# Altium schematic sheet 14_FPGA_banks_7A_8A.SchDoc: FPGA banks 7A, 8A
size A3; Organization: Lime Microsystems; Address1: Surrey Tech Centre; Address2: Guildford GU2 7YG; Address3: Surrey; Address4: United Kingdom; Revision: v1.2; SheetNumber: 12; SheetTotal: 27
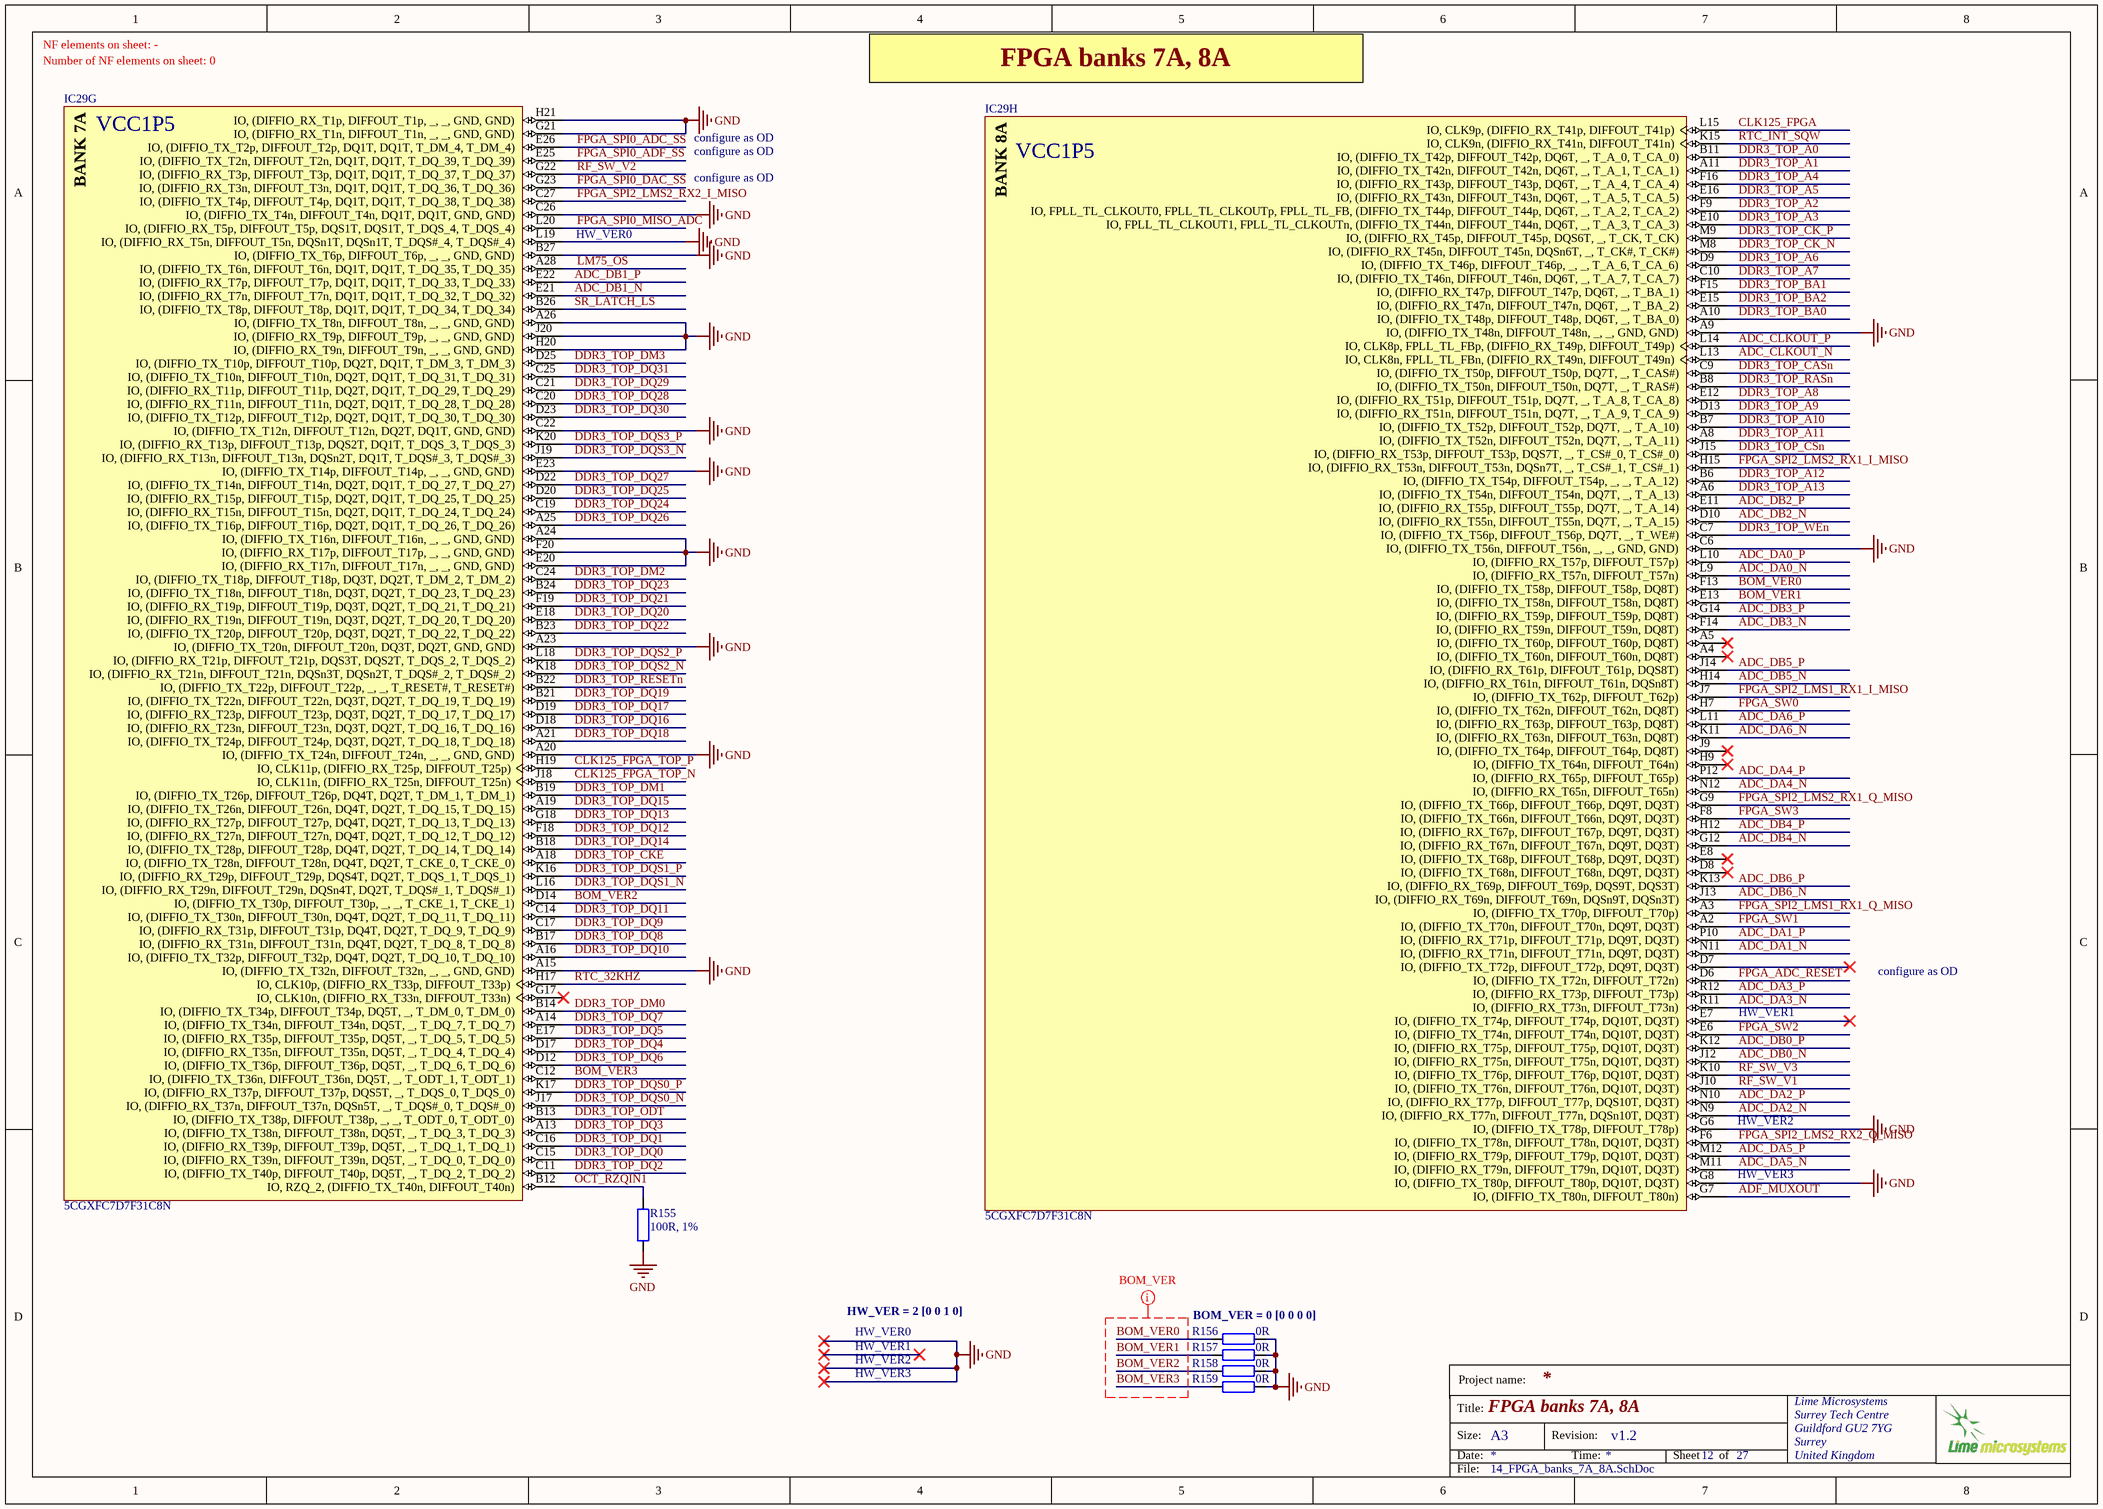
[diagram p0: 14_FPGA_banks_7A_8A.SchDoc]

## Parts
IC29  5CGXFC7D7F31C8N  [ALTR-FBGA896_A-200]  (parts G,H of 16)
R155  100R, 1%  [RES0402]
R156  0R  [RES0402]
R157  0R  [RES0402]
R158  0R  [RES0402]
R159  0R  [RES0402]

## Nets
GND: IC29.A9(IO,_(DIFFIO_TX_T48n,_DIFFOUT_T48n,__,__,_GND,_GND)) IC29.A15(IO,_(DIFFIO_TX_T32n,_DIFFOUT_T32n,__,__,_GND,_GND)) IC29.A20(IO,_(DIFFIO_TX_T24n,_DIFFOUT_T24n,__,__,_GND,_GND)) IC29.A23(IO,_(DIFFIO_TX_T20n,_DIFFOUT_T20n,_DQ3T,_DQ2T,_GND,_GND)) IC29.A24(IO,_(DIFFIO_TX_T16n,_DIFFOUT_T16n,__,__,_GND,_GND)) IC29.A26(IO,_(DIFFIO_TX_T8n,_DIFFOUT_T8n,__,__,_GND,_GND)) IC29.B27(IO,_(DIFFIO_TX_T6p,_DIFFOUT_T6p,__,__,_GND,_GND)) IC29.C6(IO,_(DIFFIO_TX_T56n,_DIFFOUT_T56n,__,__,_GND,_GND)) IC29.C22(IO,_(DIFFIO_TX_T12n,_DIFFOUT_T12n,_DQ2T,_DQ1T,_GND,_GND)) IC29.C26(IO,_(DIFFIO_TX_T4n,_DIFFOUT_T4n,_DQ1T,_DQ1T,_GND,_GND)) IC29.E20(IO,_(DIFFIO_RX_T17n,_DIFFOUT_T17n,__,__,_GND,_GND)) IC29.E23(IO,_(DIFFIO_TX_T14p,_DIFFOUT_T14p,__,__,_GND,_GND)) IC29.F20(IO,_(DIFFIO_RX_T17p,_DIFFOUT_T17p,__,__,_GND,_GND)) IC29.G6(IO,_(DIFFIO_TX_T78p,_DIFFOUT_T78p)) IC29.G8(IO,_(DIFFIO_TX_T80p,_DIFFOUT_T80p,_DQ10T,_DQ3T)) IC29.G21(IO,_(DIFFIO_RX_T1n,_DIFFOUT_T1n,__,__,_GND,_GND)) IC29.H20(IO,_(DIFFIO_RX_T9n,_DIFFOUT_T9n,__,__,_GND,_GND)) IC29.H21(IO,_(DIFFIO_RX_T1p,_DIFFOUT_T1p,__,__,_GND,_GND)) IC29.J20(IO,_(DIFFIO_RX_T9p,_DIFFOUT_T9p,__,__,_GND,_GND)) IC29.L19(IO,_(DIFFIO_RX_T5n,_DIFFOUT_T5n,_DQSn1T,_DQSn1T,_T_DQS#_4,_T_DQS#_4)) R155.1 R156.2 R157.2 R158.2 R159.2
ADC_CLKOUT_N: IC29.L13(IO,_CLK8n,_FPLL_TL_FBn,_(DIFFIO_RX_T49n,_DIFFOUT_T49n))
ADC_CLKOUT_P: IC29.L14(IO,_CLK8p,_FPLL_TL_FBp,_(DIFFIO_RX_T49p,_DIFFOUT_T49p))
ADC_DA0_N: IC29.L9(IO,_(DIFFIO_RX_T57n,_DIFFOUT_T57n))
ADC_DA0_P: IC29.L10(IO,_(DIFFIO_RX_T57p,_DIFFOUT_T57p))
ADC_DA1_N: IC29.N11(IO,_(DIFFIO_RX_T71n,_DIFFOUT_T71n,_DQ9T,_DQ3T))
ADC_DA1_P: IC29.P10(IO,_(DIFFIO_RX_T71p,_DIFFOUT_T71p,_DQ9T,_DQ3T))
ADC_DA2_N: IC29.N9(IO,_(DIFFIO_RX_T77n,_DIFFOUT_T77n,_DQSn10T,_DQ3T))
ADC_DA2_P: IC29.N10(IO,_(DIFFIO_RX_T77p,_DIFFOUT_T77p,_DQS10T,_DQ3T))
ADC_DA3_N: IC29.R11(IO,_(DIFFIO_RX_T73n,_DIFFOUT_T73n))
ADC_DA3_P: IC29.R12(IO,_(DIFFIO_RX_T73p,_DIFFOUT_T73p))
ADC_DA4_N: IC29.N12(IO,_(DIFFIO_RX_T65n,_DIFFOUT_T65n))
ADC_DA4_P: IC29.P12(IO,_(DIFFIO_RX_T65p,_DIFFOUT_T65p))
ADC_DA5_N: IC29.M11(IO,_(DIFFIO_RX_T79n,_DIFFOUT_T79n,_DQ10T,_DQ3T))
ADC_DA5_P: IC29.M12(IO,_(DIFFIO_RX_T79p,_DIFFOUT_T79p,_DQ10T,_DQ3T))
ADC_DA6_N: IC29.K11(IO,_(DIFFIO_RX_T63n,_DIFFOUT_T63n,_DQ8T))
ADC_DA6_P: IC29.L11(IO,_(DIFFIO_RX_T63p,_DIFFOUT_T63p,_DQ8T))
ADC_DB0_N: IC29.J12(IO,_(DIFFIO_RX_T75n,_DIFFOUT_T75n,_DQ10T,_DQ3T))
ADC_DB0_P: IC29.K12(IO,_(DIFFIO_RX_T75p,_DIFFOUT_T75p,_DQ10T,_DQ3T))
ADC_DB1_N: IC29.E21(IO,_(DIFFIO_RX_T7n,_DIFFOUT_T7n,_DQ1T,_DQ1T,_T_DQ_32,_T_DQ_32))
ADC_DB1_P: IC29.E22(IO,_(DIFFIO_RX_T7p,_DIFFOUT_T7p,_DQ1T,_DQ1T,_T_DQ_33,_T_DQ_33))
ADC_DB2_N: IC29.D10(IO,_(DIFFIO_RX_T55n,_DIFFOUT_T55n,_DQ7T,__,_T_A_15))
ADC_DB2_P: IC29.E11(IO,_(DIFFIO_RX_T55p,_DIFFOUT_T55p,_DQ7T,__,_T_A_14))
ADC_DB3_N: IC29.F14(IO,_(DIFFIO_RX_T59n,_DIFFOUT_T59n,_DQ8T))
ADC_DB3_P: IC29.G14(IO,_(DIFFIO_RX_T59p,_DIFFOUT_T59p,_DQ8T))
ADC_DB4_N: IC29.G12(IO,_(DIFFIO_RX_T67n,_DIFFOUT_T67n,_DQ9T,_DQ3T))
ADC_DB4_P: IC29.H12(IO,_(DIFFIO_RX_T67p,_DIFFOUT_T67p,_DQ9T,_DQ3T))
ADC_DB5_N: IC29.H14(IO,_(DIFFIO_RX_T61n,_DIFFOUT_T61n,_DQSn8T))
ADC_DB5_P: IC29.J14(IO,_(DIFFIO_RX_T61p,_DIFFOUT_T61p,_DQS8T))
ADC_DB6_N: IC29.J13(IO,_(DIFFIO_RX_T69n,_DIFFOUT_T69n,_DQSn9T,_DQSn3T))
ADC_DB6_P: IC29.K13(IO,_(DIFFIO_RX_T69p,_DIFFOUT_T69p,_DQS9T,_DQS3T))
ADF_MUXOUT: IC29.G7(IO,_(DIFFIO_TX_T80n,_DIFFOUT_T80n))
BOM_VER0: IC29.F13(IO,_(DIFFIO_TX_T58p,_DIFFOUT_T58p,_DQ8T)) R156.1
BOM_VER1: IC29.E13(IO,_(DIFFIO_TX_T58n,_DIFFOUT_T58n,_DQ8T)) R157.1
BOM_VER2: IC29.D14(IO,_(DIFFIO_TX_T30p,_DIFFOUT_T30p,__,__,_T_CKE_1,_T_CKE_1)) R158.1
BOM_VER3: IC29.C12(IO,_(DIFFIO_TX_T36n,_DIFFOUT_T36n,_DQ5T,__,_T_ODT_1,_T_ODT_1)) R159.1
CLK125_FPGA: IC29.L15(IO,_CLK9p,_(DIFFIO_RX_T41p,_DIFFOUT_T41p))
CLK125_FPGA_TOP_N: IC29.J18(IO,_CLK11n,_(DIFFIO_RX_T25n,_DIFFOUT_T25n))
CLK125_FPGA_TOP_P: IC29.H19(IO,_CLK11p,_(DIFFIO_RX_T25p,_DIFFOUT_T25p))
DDR3_TOP_A0: IC29.B11(IO,_(DIFFIO_TX_T42p,_DIFFOUT_T42p,_DQ6T,__,_T_A_0,_T_CA_0))
DDR3_TOP_A1: IC29.A11(IO,_(DIFFIO_TX_T42n,_DIFFOUT_T42n,_DQ6T,__,_T_A_1,_T_CA_1))
DDR3_TOP_A2: IC29.F9(IO,_FPLL_TL_CLKOUT0,_FPLL_TL_CLKOUTp,_FPLL_TL_FB,_(DIFFIO_TX_T44p,_DIFFOUT_T44p,_DQ6T,__,_T_A_2,_T_CA_2))
DDR3_TOP_A3: IC29.E10(IO,_FPLL_TL_CLKOUT1,_FPLL_TL_CLKOUTn,_(DIFFIO_TX_T44n,_DIFFOUT_T44n,_DQ6T,__,_T_A_3,_T_CA_3))
DDR3_TOP_A4: IC29.F16(IO,_(DIFFIO_RX_T43p,_DIFFOUT_T43p,_DQ6T,__,_T_A_4,_T_CA_4))
DDR3_TOP_A5: IC29.E16(IO,_(DIFFIO_RX_T43n,_DIFFOUT_T43n,_DQ6T,__,_T_A_5,_T_CA_5))
DDR3_TOP_A6: IC29.D9(IO,_(DIFFIO_TX_T46p,_DIFFOUT_T46p,__,__,_T_A_6,_T_CA_6))
DDR3_TOP_A7: IC29.C10(IO,_(DIFFIO_TX_T46n,_DIFFOUT_T46n,_DQ6T,__,_T_A_7,_T_CA_7))
DDR3_TOP_A8: IC29.E12(IO,_(DIFFIO_RX_T51p,_DIFFOUT_T51p,_DQ7T,__,_T_A_8,_T_CA_8))
DDR3_TOP_A9: IC29.D13(IO,_(DIFFIO_RX_T51n,_DIFFOUT_T51n,_DQ7T,__,_T_A_9,_T_CA_9))
DDR3_TOP_A10: IC29.B7(IO,_(DIFFIO_TX_T52p,_DIFFOUT_T52p,_DQ7T,__,_T_A_10))
DDR3_TOP_A11: IC29.A8(IO,_(DIFFIO_TX_T52n,_DIFFOUT_T52n,_DQ7T,__,_T_A_11))
DDR3_TOP_A12: IC29.B6(IO,_(DIFFIO_TX_T54p,_DIFFOUT_T54p,__,__,_T_A_12))
DDR3_TOP_A13: IC29.A6(IO,_(DIFFIO_TX_T54n,_DIFFOUT_T54n,_DQ7T,__,_T_A_13))
DDR3_TOP_BA0: IC29.A10(IO,_(DIFFIO_TX_T48p,_DIFFOUT_T48p,_DQ6T,__,_T_BA_0))
DDR3_TOP_BA1: IC29.F15(IO,_(DIFFIO_RX_T47p,_DIFFOUT_T47p,_DQ6T,__,_T_BA_1))
DDR3_TOP_BA2: IC29.E15(IO,_(DIFFIO_RX_T47n,_DIFFOUT_T47n,_DQ6T,__,_T_BA_2))
DDR3_TOP_CASn: IC29.C9(IO,_(DIFFIO_TX_T50p,_DIFFOUT_T50p,_DQ7T,__,_T_CAS#))
DDR3_TOP_CK_N: IC29.M8(IO,_(DIFFIO_RX_T45n,_DIFFOUT_T45n,_DQSn6T,__,_T_CK#,_T_CK#))
DDR3_TOP_CK_P: IC29.M9(IO,_(DIFFIO_RX_T45p,_DIFFOUT_T45p,_DQS6T,__,_T_CK,_T_CK))
DDR3_TOP_CKE: IC29.A18(IO,_(DIFFIO_TX_T28n,_DIFFOUT_T28n,_DQ4T,_DQ2T,_T_CKE_0,_T_CKE_0))
DDR3_TOP_CSn: IC29.J15(IO,_(DIFFIO_RX_T53p,_DIFFOUT_T53p,_DQS7T,__,_T_CS#_0,_T_CS#_0))
DDR3_TOP_DM0: IC29.B14(IO,_(DIFFIO_TX_T34p,_DIFFOUT_T34p,_DQ5T,__,_T_DM_0,_T_DM_0))
DDR3_TOP_DM1: IC29.B19(IO,_(DIFFIO_TX_T26p,_DIFFOUT_T26p,_DQ4T,_DQ2T,_T_DM_1,_T_DM_1))
DDR3_TOP_DM2: IC29.C24(IO,_(DIFFIO_TX_T18p,_DIFFOUT_T18p,_DQ3T,_DQ2T,_T_DM_2,_T_DM_2))
DDR3_TOP_DM3: IC29.D25(IO,_(DIFFIO_TX_T10p,_DIFFOUT_T10p,_DQ2T,_DQ1T,_T_DM_3,_T_DM_3))
DDR3_TOP_DQ0: IC29.C15(IO,_(DIFFIO_RX_T39n,_DIFFOUT_T39n,_DQ5T,__,_T_DQ_0,_T_DQ_0))
DDR3_TOP_DQ1: IC29.C16(IO,_(DIFFIO_RX_T39p,_DIFFOUT_T39p,_DQ5T,__,_T_DQ_1,_T_DQ_1))
DDR3_TOP_DQ2: IC29.C11(IO,_(DIFFIO_TX_T40p,_DIFFOUT_T40p,_DQ5T,__,_T_DQ_2,_T_DQ_2))
DDR3_TOP_DQ3: IC29.A13(IO,_(DIFFIO_TX_T38n,_DIFFOUT_T38n,_DQ5T,__,_T_DQ_3,_T_DQ_3))
DDR3_TOP_DQ4: IC29.D17(IO,_(DIFFIO_RX_T35n,_DIFFOUT_T35n,_DQ5T,__,_T_DQ_4,_T_DQ_4))
DDR3_TOP_DQ5: IC29.E17(IO,_(DIFFIO_RX_T35p,_DIFFOUT_T35p,_DQ5T,__,_T_DQ_5,_T_DQ_5))
DDR3_TOP_DQ6: IC29.D12(IO,_(DIFFIO_TX_T36p,_DIFFOUT_T36p,_DQ5T,__,_T_DQ_6,_T_DQ_6))
DDR3_TOP_DQ7: IC29.A14(IO,_(DIFFIO_TX_T34n,_DIFFOUT_T34n,_DQ5T,__,_T_DQ_7,_T_DQ_7))
DDR3_TOP_DQ8: IC29.B17(IO,_(DIFFIO_RX_T31n,_DIFFOUT_T31n,_DQ4T,_DQ2T,_T_DQ_8,_T_DQ_8))
DDR3_TOP_DQ9: IC29.C17(IO,_(DIFFIO_RX_T31p,_DIFFOUT_T31p,_DQ4T,_DQ2T,_T_DQ_9,_T_DQ_9))
DDR3_TOP_DQ10: IC29.A16(IO,_(DIFFIO_TX_T32p,_DIFFOUT_T32p,_DQ4T,_DQ2T,_T_DQ_10,_T_DQ_10))
DDR3_TOP_DQ11: IC29.C14(IO,_(DIFFIO_TX_T30n,_DIFFOUT_T30n,_DQ4T,_DQ2T,_T_DQ_11,_T_DQ_11))
DDR3_TOP_DQ12: IC29.F18(IO,_(DIFFIO_RX_T27n,_DIFFOUT_T27n,_DQ4T,_DQ2T,_T_DQ_12,_T_DQ_12))
DDR3_TOP_DQ13: IC29.G18(IO,_(DIFFIO_RX_T27p,_DIFFOUT_T27p,_DQ4T,_DQ2T,_T_DQ_13,_T_DQ_13))
DDR3_TOP_DQ14: IC29.B18(IO,_(DIFFIO_TX_T28p,_DIFFOUT_T28p,_DQ4T,_DQ2T,_T_DQ_14,_T_DQ_14))
DDR3_TOP_DQ15: IC29.A19(IO,_(DIFFIO_TX_T26n,_DIFFOUT_T26n,_DQ4T,_DQ2T,_T_DQ_15,_T_DQ_15))
DDR3_TOP_DQ16: IC29.D18(IO,_(DIFFIO_RX_T23n,_DIFFOUT_T23n,_DQ3T,_DQ2T,_T_DQ_16,_T_DQ_16))
DDR3_TOP_DQ17: IC29.D19(IO,_(DIFFIO_RX_T23p,_DIFFOUT_T23p,_DQ3T,_DQ2T,_T_DQ_17,_T_DQ_17))
DDR3_TOP_DQ18: IC29.A21(IO,_(DIFFIO_TX_T24p,_DIFFOUT_T24p,_DQ3T,_DQ2T,_T_DQ_18,_T_DQ_18))
DDR3_TOP_DQ19: IC29.B21(IO,_(DIFFIO_TX_T22n,_DIFFOUT_T22n,_DQ3T,_DQ2T,_T_DQ_19,_T_DQ_19))
DDR3_TOP_DQ20: IC29.E18(IO,_(DIFFIO_RX_T19n,_DIFFOUT_T19n,_DQ3T,_DQ2T,_T_DQ_20,_T_DQ_20))
DDR3_TOP_DQ21: IC29.F19(IO,_(DIFFIO_RX_T19p,_DIFFOUT_T19p,_DQ3T,_DQ2T,_T_DQ_21,_T_DQ_21))
DDR3_TOP_DQ22: IC29.B23(IO,_(DIFFIO_TX_T20p,_DIFFOUT_T20p,_DQ3T,_DQ2T,_T_DQ_22,_T_DQ_22))
DDR3_TOP_DQ23: IC29.B24(IO,_(DIFFIO_TX_T18n,_DIFFOUT_T18n,_DQ3T,_DQ2T,_T_DQ_23,_T_DQ_23))
DDR3_TOP_DQ24: IC29.C19(IO,_(DIFFIO_RX_T15n,_DIFFOUT_T15n,_DQ2T,_DQ1T,_T_DQ_24,_T_DQ_24))
DDR3_TOP_DQ25: IC29.D20(IO,_(DIFFIO_RX_T15p,_DIFFOUT_T15p,_DQ2T,_DQ1T,_T_DQ_25,_T_DQ_25))
DDR3_TOP_DQ26: IC29.A25(IO,_(DIFFIO_TX_T16p,_DIFFOUT_T16p,_DQ2T,_DQ1T,_T_DQ_26,_T_DQ_26))
DDR3_TOP_DQ27: IC29.D22(IO,_(DIFFIO_TX_T14n,_DIFFOUT_T14n,_DQ2T,_DQ1T,_T_DQ_27,_T_DQ_27))
DDR3_TOP_DQ28: IC29.C20(IO,_(DIFFIO_RX_T11n,_DIFFOUT_T11n,_DQ2T,_DQ1T,_T_DQ_28,_T_DQ_28))
DDR3_TOP_DQ29: IC29.C21(IO,_(DIFFIO_RX_T11p,_DIFFOUT_T11p,_DQ2T,_DQ1T,_T_DQ_29,_T_DQ_29))
DDR3_TOP_DQ30: IC29.D23(IO,_(DIFFIO_TX_T12p,_DIFFOUT_T12p,_DQ2T,_DQ1T,_T_DQ_30,_T_DQ_30))
DDR3_TOP_DQ31: IC29.C25(IO,_(DIFFIO_TX_T10n,_DIFFOUT_T10n,_DQ2T,_DQ1T,_T_DQ_31,_T_DQ_31))
DDR3_TOP_DQS0_N: IC29.J17(IO,_(DIFFIO_RX_T37n,_DIFFOUT_T37n,_DQSn5T,__,_T_DQS#_0,_T_DQS#_0))
DDR3_TOP_DQS0_P: IC29.K17(IO,_(DIFFIO_RX_T37p,_DIFFOUT_T37p,_DQS5T,__,_T_DQS_0,_T_DQS_0))
DDR3_TOP_DQS1_N: IC29.L16(IO,_(DIFFIO_RX_T29n,_DIFFOUT_T29n,_DQSn4T,_DQ2T,_T_DQS#_1,_T_DQS#_1))
DDR3_TOP_DQS1_P: IC29.K16(IO,_(DIFFIO_RX_T29p,_DIFFOUT_T29p,_DQS4T,_DQ2T,_T_DQS_1,_T_DQS_1))
DDR3_TOP_DQS2_N: IC29.K18(IO,_(DIFFIO_RX_T21n,_DIFFOUT_T21n,_DQSn3T,_DQSn2T,_T_DQS#_2,_T_DQS#_2))
DDR3_TOP_DQS2_P: IC29.L18(IO,_(DIFFIO_RX_T21p,_DIFFOUT_T21p,_DQS3T,_DQS2T,_T_DQS_2,_T_DQS_2))
DDR3_TOP_DQS3_N: IC29.J19(IO,_(DIFFIO_RX_T13n,_DIFFOUT_T13n,_DQSn2T,_DQ1T,_T_DQS#_3,_T_DQS#_3))
DDR3_TOP_DQS3_P: IC29.K20(IO,_(DIFFIO_RX_T13p,_DIFFOUT_T13p,_DQS2T,_DQ1T,_T_DQS_3,_T_DQS_3))
DDR3_TOP_ODT: IC29.B13(IO,_(DIFFIO_TX_T38p,_DIFFOUT_T38p,__,__,_T_ODT_0,_T_ODT_0))
DDR3_TOP_RASn: IC29.B8(IO,_(DIFFIO_TX_T50n,_DIFFOUT_T50n,_DQ7T,__,_T_RAS#))
DDR3_TOP_RESETn: IC29.B22(IO,_(DIFFIO_TX_T22p,_DIFFOUT_T22p,__,__,_T_RESET#,_T_RESET#))
DDR3_TOP_WEn: IC29.C7(IO,_(DIFFIO_TX_T56p,_DIFFOUT_T56p,_DQ7T,__,_T_WE#))
FPGA_ADC_RESET: IC29.D6(IO,_(DIFFIO_TX_T72n,_DIFFOUT_T72n))
FPGA_SPI0_ADC_SS: IC29.E26(IO,_(DIFFIO_TX_T2p,_DIFFOUT_T2p,_DQ1T,_DQ1T,_T_DM_4,_T_DM_4))
FPGA_SPI0_ADF_SS: IC29.E25(IO,_(DIFFIO_TX_T2n,_DIFFOUT_T2n,_DQ1T,_DQ1T,_T_DQ_39,_T_DQ_39))
FPGA_SPI0_DAC_SS: IC29.G23(IO,_(DIFFIO_RX_T3n,_DIFFOUT_T3n,_DQ1T,_DQ1T,_T_DQ_36,_T_DQ_36))
FPGA_SPI0_MISO_ADC: IC29.L20(IO,_(DIFFIO_RX_T5p,_DIFFOUT_T5p,_DQS1T,_DQS1T,_T_DQS_4,_T_DQS_4))
FPGA_SPI2_LMS1_RX1_I_MISO: IC29.J7(IO,_(DIFFIO_TX_T62p,_DIFFOUT_T62p))
FPGA_SPI2_LMS1_RX1_Q_MISO: IC29.A3(IO,_(DIFFIO_TX_T70p,_DIFFOUT_T70p))
FPGA_SPI2_LMS2_RX1_I_MISO: IC29.H15(IO,_(DIFFIO_RX_T53n,_DIFFOUT_T53n,_DQSn7T,__,_T_CS#_1,_T_CS#_1))
FPGA_SPI2_LMS2_RX1_Q_MISO: IC29.G9(IO,_(DIFFIO_TX_T66p,_DIFFOUT_T66p,_DQ9T,_DQ3T))
FPGA_SPI2_LMS2_RX2_I_MISO: IC29.C27(IO,_(DIFFIO_TX_T4p,_DIFFOUT_T4p,_DQ1T,_DQ1T,_T_DQ_38,_T_DQ_38))
FPGA_SPI2_LMS2_RX2_Q_MISO: IC29.F6(IO,_(DIFFIO_TX_T78n,_DIFFOUT_T78n,_DQ10T,_DQ3T))
FPGA_SW0: IC29.H7(IO,_(DIFFIO_TX_T62n,_DIFFOUT_T62n,_DQ8T))
FPGA_SW1: IC29.A2(IO,_(DIFFIO_TX_T70n,_DIFFOUT_T70n,_DQ9T,_DQ3T))
FPGA_SW2: IC29.E6(IO,_(DIFFIO_TX_T74n,_DIFFOUT_T74n,_DQ10T,_DQ3T))
FPGA_SW3: IC29.F8(IO,_(DIFFIO_TX_T66n,_DIFFOUT_T66n,_DQ9T,_DQ3T))
LM75_OS: IC29.A28(IO,_(DIFFIO_TX_T6n,_DIFFOUT_T6n,_DQ1T,_DQ1T,_T_DQ_35,_T_DQ_35))
OCT_RZQIN1: IC29.B12(IO,_RZQ_2,_(DIFFIO_TX_T40n,_DIFFOUT_T40n)) R155.2
RF_SW_V1: IC29.J10(IO,_(DIFFIO_TX_T76n,_DIFFOUT_T76n,_DQ10T,_DQ3T))
RF_SW_V2: IC29.G22(IO,_(DIFFIO_RX_T3p,_DIFFOUT_T3p,_DQ1T,_DQ1T,_T_DQ_37,_T_DQ_37))
RF_SW_V3: IC29.K10(IO,_(DIFFIO_TX_T76p,_DIFFOUT_T76p,_DQ10T,_DQ3T))
RTC_32KHZ: IC29.H17(IO,_CLK10p,_(DIFFIO_RX_T33p,_DIFFOUT_T33p))
RTC_INT_SQW: IC29.K15(IO,_CLK9n,_(DIFFIO_RX_T41n,_DIFFOUT_T41n))
SR_LATCH_LS: IC29.B26(IO,_(DIFFIO_TX_T8p,_DIFFOUT_T8p,_DQ1T,_DQ1T,_T_DQ_34,_T_DQ_34))

Not connected (* = marked no-connect by the designer): IC29 A4(IO,_(DIFFIO_TX_T60n,_DIFFOUT_T60n,_DQ8T))* A5(IO,_(DIFFIO_TX_T60p,_DIFFOUT_T60p,_DQ8T))* D7(IO,_(DIFFIO_TX_T72p,_DIFFOUT_T72p,_DQ9T,_DQ3T))* D8(IO,_(DIFFIO_TX_T68n,_DIFFOUT_T68n,_DQ9T,_DQ3T))* E7(IO,_(DIFFIO_TX_T74p,_DIFFOUT_T74p,_DQ10T,_DQ3T))* E8(IO,_(DIFFIO_TX_T68p,_DIFFOUT_T68p,_DQ9T,_DQ3T))* G17(IO,_CLK10n,_(DIFFIO_RX_T33n,_DIFFOUT_T33n))* H9(IO,_(DIFFIO_TX_T64n,_DIFFOUT_T64n))* J9(IO,_(DIFFIO_TX_T64p,_DIFFOUT_T64p,_DQ8T))*

## Layout directives
net class BOM_VER: BOM_VER0, BOM_VER1, BOM_VER2, BOM_VER3

## Notes on the sheet
- NF elements on sheet: -
- Number of NF elements on sheet: 0
- FPGA banks 7A, 8A
- VCC1P5
- configure as OD
- (near IC29) HW_VER0
- (near IC29) HW_VER1
- (near IC29) HW_VER2
- (near IC29) HW_VER3
- HW_VER = 2 [0 0 1 0]
- (near R156) BOM_VER = 0 [0 0 0 0]
- HW_VER0
- HW_VER1
- HW_VER2
- HW_VER3
- Project name:
- Title:
- Size:
- Date:
- A3
- Revision:
- Time:
- Sheet
- of
- File:
- (in symbol 5CGXFC7D7F31C8N, part G) BANK 7A
- (in symbol 5CGXFC7D7F31C8N, part H) BANK 8A

## Library data of the parts
IC29 = 5CGXFC7D7F31C8N: Cyclone V GX Family FPGA, 1.07 to 1.13 V Supply, 480 I/O Pins, 7 PLLs, 896-Pin FBGA, Speed Grade 8, Commercial Grade, RoHS Compliant; Manufacturer: Altera; Part Description: IC FPGA 480 I/O 896FBGA; GPIO: 480; Logic Elements (LE) (K): 149.5; Speed Grade: 8; DatasheetVersion: Rev. 3.4; PackageVersion: Rev. 2.0, 12/2012; PackageReference: FBGA896_A-200; PackageDescription: 896-Pin FineLine Ball-Grid Array (FBGA), Body 31 x 31 mm, Pitch 1 mm; Supplier 1: Digi-Key; Supplier Part Number 1: 544-2772-ND; Supplier 2: Mouser; Supplier Part Number 2: 989-5CGXFC7D7F31C8N; Device Group: 5CGXFC7; RoHS: RoHS Compliant; Subcategory: Cyclone V GX; Voltage Supply: 1.07 to 1.13 V; NexusDeviceID: 5CGXFC7D7F31C8N; Mounting Technology: Surface Mount; Code_JEDEC: MS-034-AAN-1; PartNumber: 5CGXFC7D7F31C8N; ComponentLink1Description: Manufacturer URL; ComponentLink1URL: http://www.altera.com; ComponentLink2Description: Datasheet; ComponentLink2URL: http://www.altera.com/literature/hb/cyclone-v/cv_51002.pdf; ComponentLink3Description: Package Specification; ComponentLink3URL: http://www.altera.com/devicepackaging/04R00435-01.pdf; ComponentLink4Description: Device Handbook URL; ComponentLink4URL: http://www.altera.com/literature/hb/cyclone-v/cyclone5_handbook.pdf; ComponentLink5Description: Device Pin-Out URL; ComponentLink5URL: http://www.altera.com/literature/dp/cyclone-v/5CGXFC7.xls; ComponentLink6Description: Device Overview URL; ComponentLink6URL: http://www.altera.com/literature/hb/cyclone-v/cv_51001.pdf; ComponentLink7Description: Product URL; ComponentLink7URL: http://www.buyaltera.com/scripts/partsearch.dll?Detail&name=5CGXFC7D7F31C8N-ND
R155 = Res_0402: Manufacturer Part Number 1: RMCF0402FT100R; Part Description: RES SMD 100 OHM 1% 1/16W 0402; Manufacturer: Stackpole Electronics Inc.; Temperature Coefficient: ±100ppm/°C; Supplier 1: Digi-Key; Supplier Part Number 1: RMCF0402FT100RDKR-ND; Package / Case: 0402 (1005 Metric); Composition: Thick Film; Category: Resistors; Tolerance: ±1%; Value: 100R, 1%
R156-R159 = Res_0402: Manufacturer: Yageo; Part Description: RES SMD 0.0OHM JUMPER 1/16W 0402; Manufacturer Part Number 1: RC0402JR-070RL; Supplier 1: Digi-Key; Supplier Part Number 1: 311-0.0JRTR-ND; Composition: Thick Film; Package / Case: 0402 (1005 Metric); Category: Resistors; Value: 0R